# Altium schematic sheet 01_uC.SchDoc: uC
size A4; SheetNumber: 2; SheetTotal: 10; DocumentTitle: 01 uC
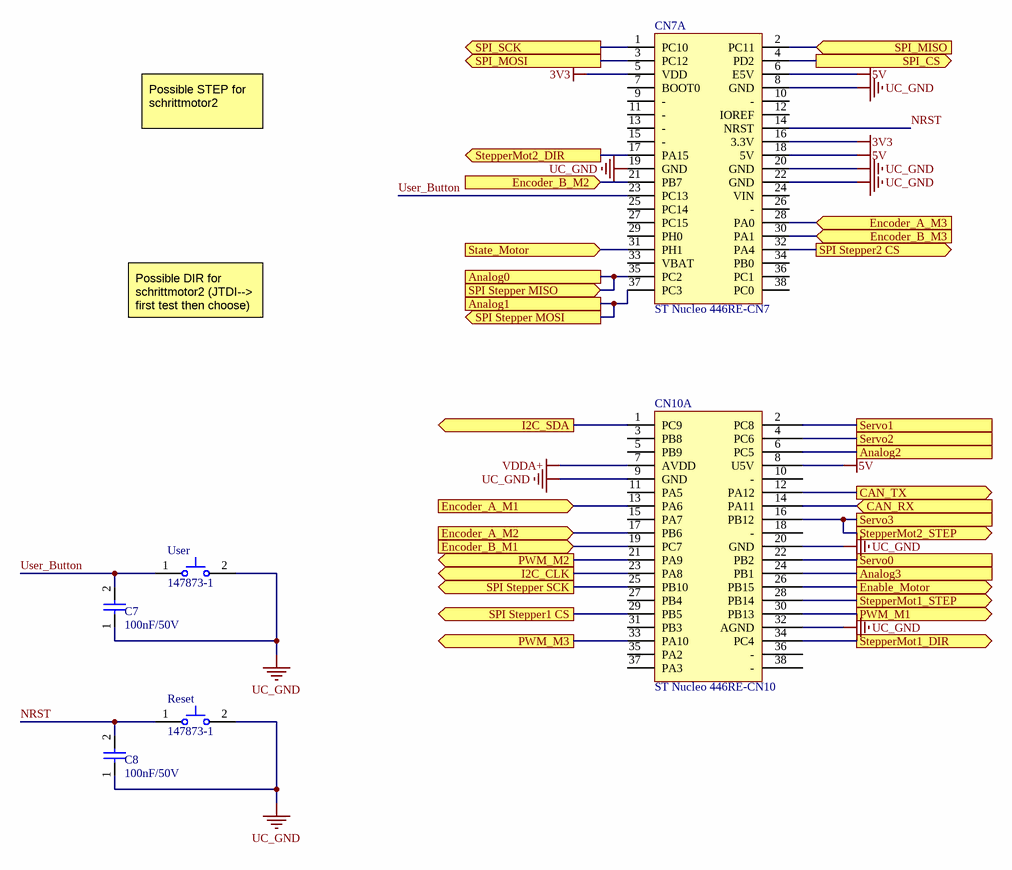
[diagram p0: 01_uC.SchDoc]

## Parts
C7  100nF/50V  [CAPC1005X05L]
C8  100nF/50V  [CAPC1005X05L]
CN7  ST Nucleo 446RE-CN7  [HD254_2x19_FV_THT]  (part A of 2)
CN10  ST Nucleo 446RE-CN10  [HD254_2x19_FV_THT]  (part A of 2)
Reset  147873-1  [TE_147873-1]
User  147873-1  [TE_147873-1]

## Ports
Analog0, Analog1, Analog2, Analog3, CAN_RX (in), CAN_TX (out), Enable_Motor (out), Encoder_A_M1 (in), Encoder_A_M2 (in), Encoder_A_M3 (in), Encoder_B_M1 (in), Encoder_B_M2 (in), Encoder_B_M3 (in), I2C_CLK (out), I2C_SDA (out), PWM_M1 (out), PWM_M2 (out), PWM_M3 (out), Servo0, Servo1, Servo2, Servo3, SPI Stepper1 CS (out), SPI Stepper2 CS (out), SPI Stepper MISO (in), SPI Stepper MOSI (out), SPI Stepper SCK (out), SPI_CS (out), SPI_MISO (in), SPI_MOSI (out), SPI_SCK (out), State_Motor (in), StepperMot1_DIR (out), StepperMot1_STEP (out), StepperMot2_DIR (out), StepperMot2_STEP (out)

## Nets
3V3: CN7.5(VDD) CN7.16(3.3V)
5V: CN7.6(E5V) CN7.18(5V) CN10.8(U5V)
UC_GND: C7.1 C8.1 CN7.8(GND) CN7.19(GND) CN7.20(GND) CN7.22(GND) CN10.9(GND) CN10.20(GND) CN10.32(AGND) Reset.2 User.2
VDDA+: CN10.7(AVDD)
Analog0: CN7.35(PC2) ; port Analog0, port SPI Stepper MISO
Analog1: CN7.37(PC3) ; port Analog1, port SPI Stepper MOSI
Analog2: CN10.6(PC5) ; port Analog2
Analog3: CN10.24(PB1) ; port Analog3
CAN_RX: CN10.14(PA11) ; port CAN_RX
CAN_TX: CN10.12(PA12) ; port CAN_TX
Enable_Motor: CN10.26(PB15) ; port Enable_Motor
Encoder_A_M1: CN10.13(PA6) ; port Encoder_A_M1
Encoder_A_M2: CN10.17(PB6) ; port Encoder_A_M2
Encoder_A_M3: CN7.28(PA0) ; port Encoder_A_M3
Encoder_B_M1: CN10.19(PC7) ; port Encoder_B_M1
Encoder_B_M2: CN7.21(PB7) ; port Encoder_B_M2
Encoder_B_M3: CN7.30(PA1) ; port Encoder_B_M3
I2C_CLK: CN10.23(PA8) ; port I2C_CLK
I2C_SDA: CN10.1(PC9) ; port I2C_SDA
NRST: C8.2 CN7.14(NRST) Reset.1
PWM_M1: CN10.30(PB13) ; port PWM_M1
PWM_M2: CN10.21(PA9) ; port PWM_M2
PWM_M3: CN10.33(PA10) ; port PWM_M3
Servo0: CN10.22(PB2) ; port Servo0
Servo1: CN10.2(PC8) ; port Servo1
Servo2: CN10.4(PC6) ; port Servo2
Servo3: CN10.16(PB12) ; port Servo3, port StepperMot2_STEP
SPI Stepper1 CS: CN10.29(PB5) ; port SPI Stepper1 CS
SPI Stepper2 CS: CN7.32(PA4) ; port SPI Stepper2 CS
SPI Stepper SCK: CN10.25(PB10) ; port SPI Stepper SCK
SPI_CS: CN7.4(PD2) ; port SPI_CS
SPI_MISO: CN7.2(PC11) ; port SPI_MISO
SPI_MOSI: CN7.3(PC12) ; port SPI_MOSI
SPI_SCK: CN7.1(PC10) ; port SPI_SCK
State_Motor: CN7.31(PH1) ; port State_Motor
StepperMot1_DIR: CN10.34(PC4) ; port StepperMot1_DIR
StepperMot1_STEP: CN10.28(PB14) ; port StepperMot1_STEP
StepperMot2_DIR: CN7.17(PA15) ; port StepperMot2_DIR
User_Button: C7.2 CN7.23(PC13) User.1

Not connected (* = marked no-connect by the designer): CN7 7(BOOT0) 9(-) 10(-) 11(-) 12(IOREF) 13(-) 15(-) 24(VIN) 25(PC14) 26(-) 27(PC15) 29(PH0) 33(VBAT) 34(PB0) 36(PC1) 38(PC0); CN10 3(PB8) 5(PB9) 10(-) 11(PA5) 15(PA7) 18(-) 27(PB4) 31(PB3) 35(PA2) 36(-) 37(PA3) 38(-)

## Notes on the sheet
- Possible STEP for schrittmotor2
- Possible DIR for schrittmotor2 (JTDI--> first test then choose)
- Schematic Name
- Document Number
- File:
- Sheet
- Size
- A4
- Project Name
- of
- Print date:
- Drawn by:
- Revision
- Repo:
- Variant:

## Library data of the parts
C7 C8 = CMP-001-00067-18: Cap MLCC, 100nF, 50V, X7R, 10%, 0402; Value: 100nF; Case/Package: 0402; Case Code (Metric): 1005; Dielectricum: X7R; Mounting Technology: SMD; Tolerance: 10%; Type: MLCC; Voltage Rating: 50V
CN7 = CMP-002-00168-22: Pinout for ST Nucleo 446RE, Connector CN7, bottom down connection, don't turn around, distance between CN7 and CN10 is 2400m (Pin 1 to Pin 1), SMD-38; Mounting Technology: SMD; Size: -; Case/Package: SMD-38
CN10 = CMP-002-00167-21: Pinout for ST Nucleo 446RE, Connector CN10, bottom down connection, don't turn around, distance between CN7 and CN10 is 2400m (Pin 1 to Pin 1), SMD-38; Size: -; Case/Package: SMD-38; Mounting Technology: SMD
Reset User = CMP-011-00025-1: Push Button, Vertical, SPST-NO, 24V, 50mA, L6B3.5H5; Illuminated: No; Type: Button; Actuation: Push; Angle: Vertical; Contact Form: SPST-NO; Contact Material: Silver; Current Rating: 50mA; Mounting Technology: SMD; Size: L6B3.5H5; Voltage Rating: 24V